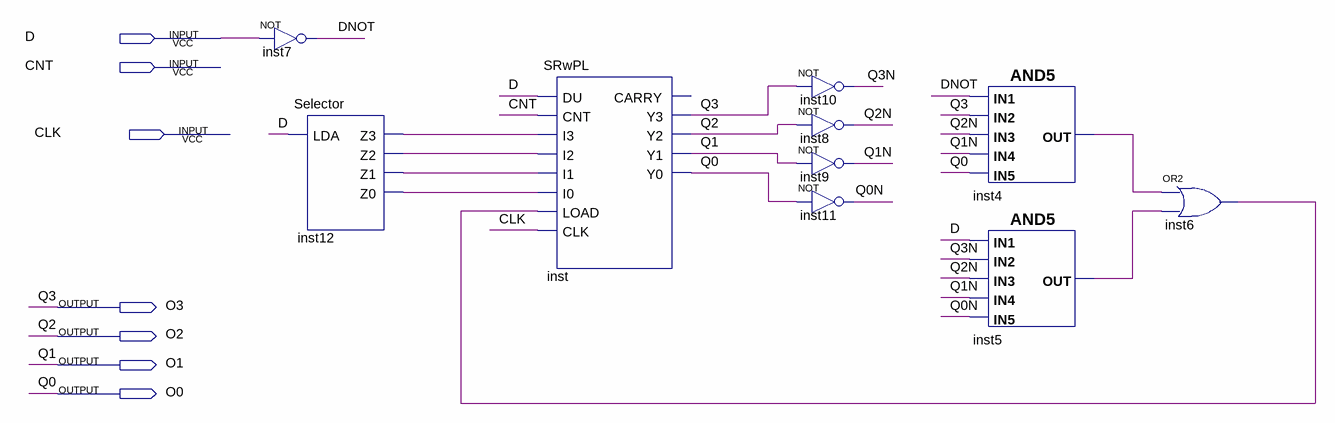
[diagram p0: schematic sheet]
// Quartus schematic BCD.bdf as structural Verilog: 10 symbols, 7 pins
module BCD (
  input  D,
  input  CNT,
  input  CLK,
  output O3,
  output O2,
  output O1,
  output O0
);

  wire DNOT, inst4_out, inst5_out, inst6_out, inst12_z0, inst12_z1, inst12_z2, inst12_z3, Q0N, Q1N, Q2N, Q3N;

  not inst7 (DNOT, D);
  Selector inst12 (.LDA(D), .Z3(inst12_z3), .Z2(inst12_z2), .Z1(inst12_z1), .Z0(inst12_z0));
  SRwPL inst (
    .DU(D), .CNT(CNT), .I3(inst12_z3), .I2(inst12_z2), .I1(inst12_z1), .I0(inst12_z0), .LOAD(inst6_out),
    .CLK(CLK), .Y3(O3), .Y2(O2), .Y1(O1), .Y0(O0));  // open: CARRY
  not inst10 (Q3N, O3);
  not inst8 (Q2N, O2);
  not inst9 (Q1N, O1);
  not inst11 (Q0N, O0);
  and inst4 (inst4_out, DNOT, O3, Q2N, Q1N, O0);
  and inst5 (inst5_out, D, Q3N, Q2N, Q1N, Q0N);
  or inst6 (inst6_out, inst4_out, inst5_out);

  // Other names for the same wires on the sheet: Q0 = O0; Q1 = O1; Q2 = O2; Q3 = O3
endmodule
